# Altium schematic sheet 编码器.SchDoc
size A3
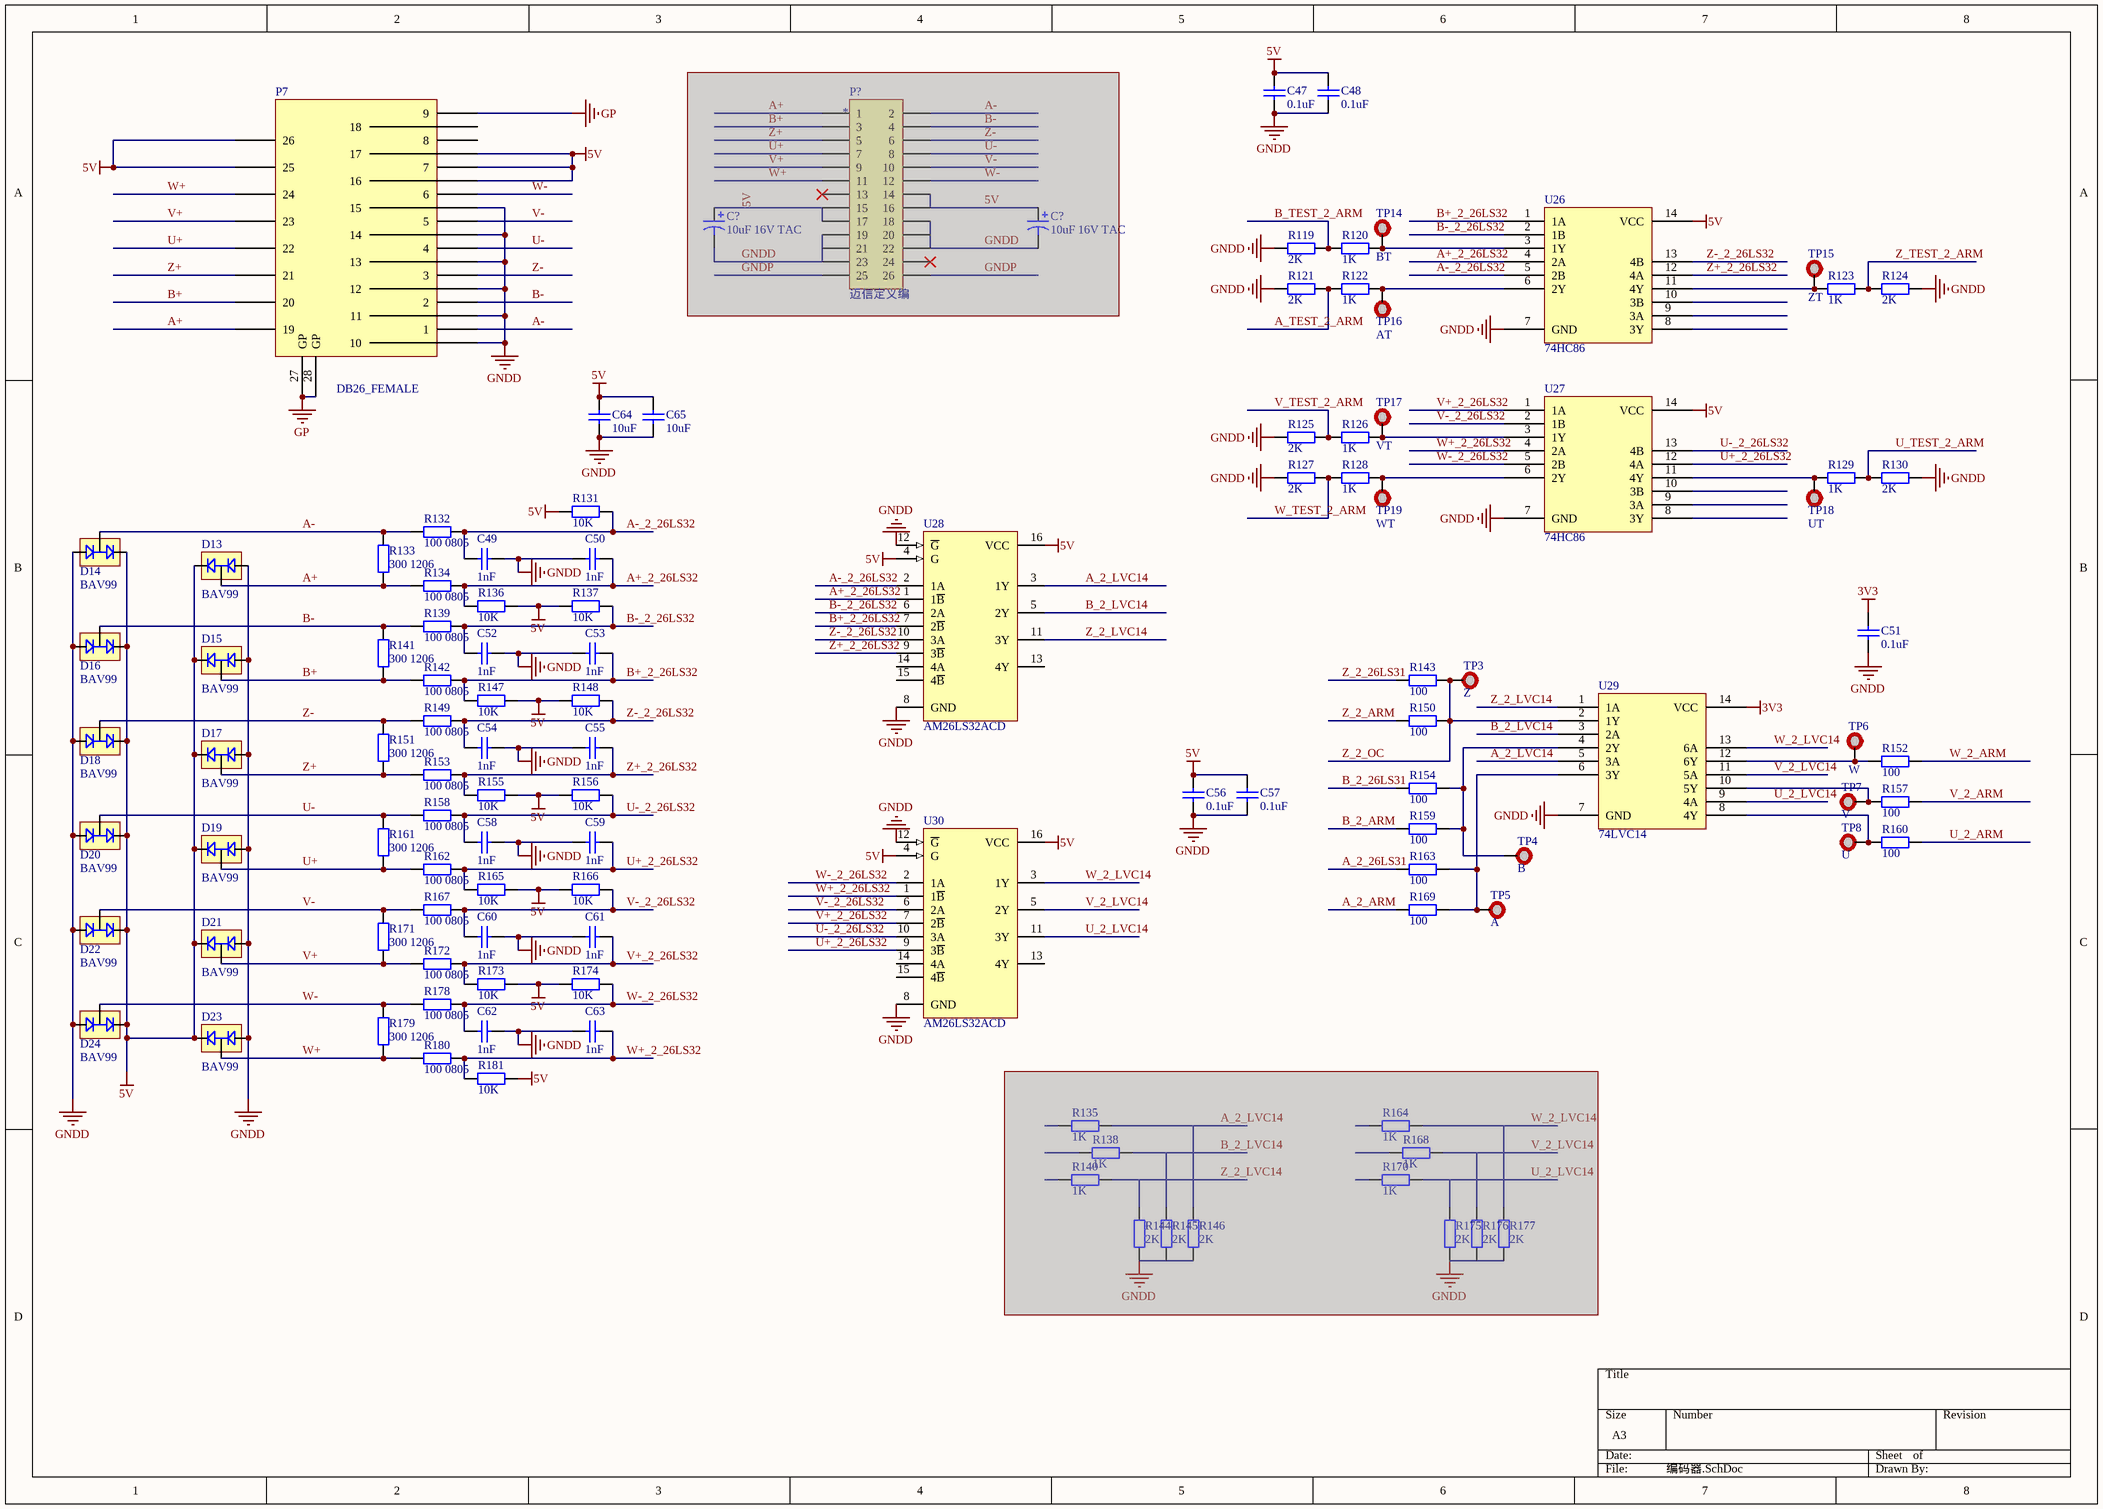
[diagram p0: 编码器.SchDoc]

## Parts
(Parts that share a designator on the sheet are numbered #1, #2 ... from top to bottom, then left to right.)
C47  0.1uF  [C SMD 0603]
C48  0.1uF  [C SMD 0603]
C49  1nF  [C SMD 0603]
C50  1nF  [C SMD 0603]
C51  0.1uF  [C SMD 0603]
C52  1nF  [C SMD 0603]
C53  1nF  [C SMD 0603]
C54  1nF  [C SMD 0603]
C55  1nF  [C SMD 0603]
C56  0.1uF  [C SMD 0603]
C57  0.1uF  [C SMD 0603]
C58  1nF  [C SMD 0603]
C59  1nF  [C SMD 0603]
C60  1nF  [C SMD 0603]
C61  1nF  [C SMD 0603]
C62  1nF  [C SMD 0603]
C63  1nF  [C SMD 0603]
C64  10uF  [C SMD 1206]
C65  10uF  [C SMD 1206]
C?#1  10uF 16V TAC  [3216TAC]  (masked out: inside a compile mask, not in the netlist)
C?#2  10uF 16V TAC  [3216TAC]  (masked out: inside a compile mask, not in the netlist)
D13  BAV99  [SOT23]
D14  BAV99  [SOT23]
D15  BAV99  [SOT23]
D16  BAV99  [SOT23]
D17  BAV99  [SOT23]
D18  BAV99  [SOT23]
D19  BAV99  [SOT23]
D20  BAV99  [SOT23]
D21  BAV99  [SOT23]
D22  BAV99  [SOT23]
D23  BAV99  [SOT23]
D24  BAV99  [SOT23]
P7  DB26_FEMALE
P?  *  [AMP26_小孔小焊盘]  (masked out: inside a compile mask, not in the netlist)
R119  2K  [R SMD 0603]
R120  1K  [R SMD 0603]
R121  2K  [R SMD 0603]
R122  1K  [R SMD 0603]
R123  1K  [R SMD 0603]
R124  2K  [R SMD 0603]
R125  2K  [R SMD 0603]
R126  1K  [R SMD 0603]
R127  2K  [R SMD 0603]
R128  1K  [R SMD 0603]
R129  1K  [R SMD 0603]
R130  2K  [R SMD 0603]
R131  10K  [R SMD 0603]
R132  100 0805  [R SMD 0805]
R133  300 1206  [R SMD 1206]
R134  100 0805  [R SMD 0805]
R135  1K  [R SMD 0603]  (masked out: inside a compile mask, not in the netlist)
R136  10K  [R SMD 0603]
R137  10K  [R SMD 0603]
R138  1K  [R SMD 0603]  (masked out: inside a compile mask, not in the netlist)
R139  100 0805  [R SMD 0805]
R140  1K  [R SMD 0603]  (masked out: inside a compile mask, not in the netlist)
R141  300 1206  [R SMD 1206]
R142  100 0805  [R SMD 0805]
R143  100  [R SMD 0603]
R144  2K  [R SMD 0603]  (masked out: inside a compile mask, not in the netlist)
R145  2K  [R SMD 0603]  (masked out: inside a compile mask, not in the netlist)
R146  2K  [R SMD 0603]  (masked out: inside a compile mask, not in the netlist)
R147  10K  [R SMD 0603]
R148  10K  [R SMD 0603]
R149  100 0805  [R SMD 0805]
R150  100  [R SMD 0603]
R151  300 1206  [R SMD 1206]
R152  100  [R SMD 0603]
R153  100 0805  [R SMD 0805]
R154  100  [R SMD 0603]
R155  10K  [R SMD 0603]
R156  10K  [R SMD 0603]
R157  100  [R SMD 0603]
R158  100 0805  [R SMD 0805]
R159  100  [R SMD 0603]
R160  100  [R SMD 0603]
R161  300 1206  [R SMD 1206]
R162  100 0805  [R SMD 0805]
R163  100  [R SMD 0603]
R164  1K  [R SMD 0603]  (masked out: inside a compile mask, not in the netlist)
R165  10K  [R SMD 0603]
R166  10K  [R SMD 0603]
R167  100 0805  [R SMD 0805]
R168  1K  [R SMD 0603]  (masked out: inside a compile mask, not in the netlist)
R169  100  [R SMD 0603]
R170  1K  [R SMD 0603]  (masked out: inside a compile mask, not in the netlist)
R171  300 1206  [R SMD 1206]
R172  100 0805  [R SMD 0805]
R173  10K  [R SMD 0603]
R174  10K  [R SMD 0603]
R175  2K  [R SMD 0603]  (masked out: inside a compile mask, not in the netlist)
R176  2K  [R SMD 0603]  (masked out: inside a compile mask, not in the netlist)
R177  2K  [R SMD 0603]  (masked out: inside a compile mask, not in the netlist)
R178  100 0805  [R SMD 0805]
R179  300 1206  [R SMD 1206]
R180  100 0805  [R SMD 0805]
R181  10K  [R SMD 0603]
TP3  Z  [测点]
TP4  B  [测点]
TP5  A  [测点]
TP6  W  [测点]
TP7  V  [测点]
TP8  U  [测点]
TP14  BT  [测点]
TP15  ZT  [测点]
TP16  AT  [测点]
TP17  VT  [测点]
TP18  UT  [测点]
TP19  WT  [测点]
U26  74HC86  [NSO14_N]
U27  74HC86  [NSO14_N]
U28  AM26LS32ACD  [NSO16_N]
U29  74LVC14  [TSSOP14]
U30  AM26LS32ACD  [NSO16_N]

## Nets
3V3: C51.1 U29.14(VCC)
5V: C47.1 C48.1 C56.1 C57.1 C64.1 C65.1 D13.2 D14.2 D15.2 D16.2 D17.2 D18.2 D19.2 D20.2 D21.2 D22.2 D23.2 D24.2 P7.7 P7.16 P7.17 P7.25 P7.26 R131.2 R136.2 R137.1 R147.2 R148.1 R155.2 R156.1 R165.2 R166.1 R173.2 R174.1 R181.2 U26.14(VCC) U27.14(VCC) U28.4(G) U28.16(VCC) U30.4(G) U30.16(VCC)
GNDD: C47.2 C48.2 C49.1 C50.2 C51.2 C52.1 C53.2 C54.1 C55.2 C56.2 C57.2 C58.1 C59.2 C60.1 C61.2 C62.1 C63.2 C64.2 C65.2 D13.1 D14.1 D15.1 D16.1 D17.1 D18.1 D19.1 D20.1 D21.1 D22.1 D23.1 D24.1 P7.10 P7.11 P7.12 P7.13 P7.14 P7.15 R119.2 R121.2 R124.2 R125.2 R127.2 R130.2 U26.7(GND) U27.7(GND) U28.8(GND) U28.12(~{G}) U29.7(GND) U30.8(GND) U30.12(~{G})
GP: P7.9 P7.27(GP) P7.28(GP)
A+: D13.3 P7.19 R133.2 R134.1
A+_2_26LS32: C50.1 R134.2 R136.1 U26.4(2A) U28.1(1~{B})
A-: D14.3 P7.1 R132.1 R133.1
A-_2_26LS32: C49.2 R131.1 R132.2 U26.5(2B) U28.2(1A)
A_2_26LS31: R163.1
A_2_ARM: R169.1
A_2_LVC14: U28.3(1Y) U29.5(3A)
A_TEST_2_ARM: R121.1 R122.2
B+: D15.3 P7.20 R141.2 R142.1
B+_2_26LS32: C53.1 R142.2 R147.1 U26.1(1A) U28.7(2~{B})
B-: D16.3 P7.2 R139.1 R141.1
B-_2_26LS32: C52.2 R137.2 R139.2 U26.2(1B) U28.6(2A)
B_2_26LS31: R154.1
B_2_ARM: R159.1
B_2_LVC14: U28.5(2Y) U29.3(2A)
B_TEST_2_ARM: R119.1 R120.2
U+: D19.3 P7.22 R161.2 R162.1
U+_2_26LS32: C59.1 R162.2 R165.1 U27.12(4A) U30.9(3~{B})
U-: D20.3 P7.4 R158.1 R161.1
U-_2_26LS32: C58.2 R156.2 R158.2 U27.13(4B) U30.10(3A)
U_2_ARM: R160.2
U_2_LVC14: U29.9(4A) U30.11(3Y)
U_TEST_2_ARM: R129.2 R130.1
V+: D21.3 P7.23 R171.2 R172.1
V+_2_26LS32: C61.1 R172.2 R173.1 U27.1(1A) U30.7(2~{B})
V-: D22.3 P7.5 R167.1 R171.1
V-_2_26LS32: C60.2 R166.2 R167.2 U27.2(1B) U30.6(2A)
V_2_ARM: R157.2
V_2_LVC14: U29.11(5A) U30.5(2Y)
V_TEST_2_ARM: R125.1 R126.2
W+: D23.3 P7.24 R179.2 R180.1
W+_2_26LS32: C63.1 R180.2 R181.1 U27.4(2A) U30.1(1~{B})
W-: D24.3 P7.6 R178.1 R179.1
W-_2_26LS32: C62.2 R174.2 R178.2 U27.5(2B) U30.2(1A)
W_2_ARM: R152.2
W_2_LVC14: U29.13(6A) U30.3(1Y)
W_TEST_2_ARM: R127.1 R128.2
Z+: D17.3 P7.21 R151.2 R153.1
Z+_2_26LS32: C55.1 R153.2 R155.1 U26.12(4A) U28.9(3~{B})
Z-: D18.3 P7.3 R149.1 R151.1
Z-_2_26LS32: C54.2 R148.2 R149.2 U26.13(4B) U28.10(3A)
Z_2_26LS31: R143.1
Z_2_ARM: R150.1
Z_2_LVC14: U28.11(3Y) U29.1(1A)
Z_2_OC: R143.2 R150.2 TP3.1 U29.2(1Y)
Z_TEST_2_ARM: R123.2 R124.1
NetR120_1: R120.1 TP14.1 U26.3(1Y)
NetR122_1: R122.1 TP16.1 U26.6(2Y)
NetR123_1: R123.1 TP15.1 U26.11(4Y)
NetR126_1: R126.1 TP17.1 U27.3(1Y)
NetR128_1: R128.1 TP19.1 U27.6(2Y)
NetR129_1: R129.1 TP18.1 U27.11(4Y)
NetR152_1: R152.1 TP6.1 U29.12(6Y)
NetR154_2: R154.2 R159.2 TP4.1 U29.4(2Y)
NetR157_1: R157.1 TP7.1 U29.10(5Y)
NetR160_1: R160.1 TP8.1 U29.8(4Y)
NetR163_2: R163.2 R169.2 TP5.1 U29.6(3Y)

Not connected (* = marked no-connect by the designer): P7 8 18; U26 8(3Y) 9(3A) 10(3B); U27 8(3Y) 9(3A) 10(3B); U28 13(4Y) 14(4A) 15(4~{B}); U30 13(4Y) 14(4A) 15(4~{B})

## Notes on the sheet
- (in symbol Header 13X2) 迈信定义编

## Library data of the parts
C47 C48 C51 C56 C57 = Cap: Capacitor; Published: 8-Jun-2000; LatestRevisionDate: 17-Jul-2002; LatestRevisionNote: Re-released for DXP Platform.; PackageReference: RAD-0.3; Publisher: Altium Limited; PackageDescription: Radial Cap, Thru-Hole; 2 Leads; 0.3 in Pin Spacing; Value: 0.1uF
C49 C50 C52-C55 C58-C65 = Cap: Capacitor; Value: 0.1uF; Published: 8-Jun-2000; LatestRevisionDate: 17-Jul-2002; LatestRevisionNote: Re-released for DXP Platform.; PackageReference: RAD-0.3; Publisher: Altium Limited; PackageDescription: Radial Cap, Thru-Hole; 2 Leads; 0.3 in Pin Spacing
C?#1 C?#2 = Cap Pol1: Polarized Capacitor (Radial); Value: 2.2uF; Published: 8-Jun-2000; LatestRevisionDate: 17-Jul-2002; LatestRevisionNote: Re-released for DXP Platform.; PackageReference: RB7.6-15; Publisher: Altium Limited; PackageDescription: Polarized Capacitor (Radial); 2 Leads
P? = Header 13X2: Header, 13-Pin, Dual row; LatestRevisionDate: 17-Jul-2002; LatestRevisionNote: Re-released for DXP Platform.; Publisher: Altium Limited
R119-R142 R144-R149 R151 R153 R155 R156 R158 R161 R162 R164-R168 R170-R181 = Res2: Resistor; Value: Rx; Published: 8-Jun-2000; LatestRevisionDate: 17-Jul-2002; LatestRevisionNote: Re-released for DXP Platform.; PackageReference: AXIAL-0.4; Publisher: Altium Limited
R143 R150 R152 R154 R157 R159 R160 R163 R169 = Res2: Resistor; Value: 3K; Published: 8-Jun-2000; LatestRevisionDate: 17-Jul-2002; LatestRevisionNote: Re-released for DXP Platform.; PackageReference: AXIAL-0.4; Publisher: Altium Limited
TP3-TP8 TP14-TP19 = TEST_POINT
U28 U30 = AM26LS32ACD: Quadruple Differential Line Receiver; Note: Inputs have hysteresis (50mV typical).; Published: 15-May-2002; LatestRevisionDate: 13-Apr-2006; LatestRevisionNote: IPC-7351 Footprint Added.; DatasheetVersion: Sep-1986; PackageVersion: Jan-1998; PackageReference: D016; Publisher: Altium Limited; PackageDescription: 16-Pin Small Outline Integrated Circuit 1.27 mm Pitch; Code_IPC: SOIC127P600-16; ComponentLink1Description: Manufacturer Link; ComponentLink1URL: http://www.ti.com/; ComponentLink2Description: Datasheet; ComponentLink2URL: http://www-s.ti.com/sc/ds/am26ls32a.pdf